# EAGLE design DIY_OpenEVSE_Arduino_Shield (EAGLE 6.2)
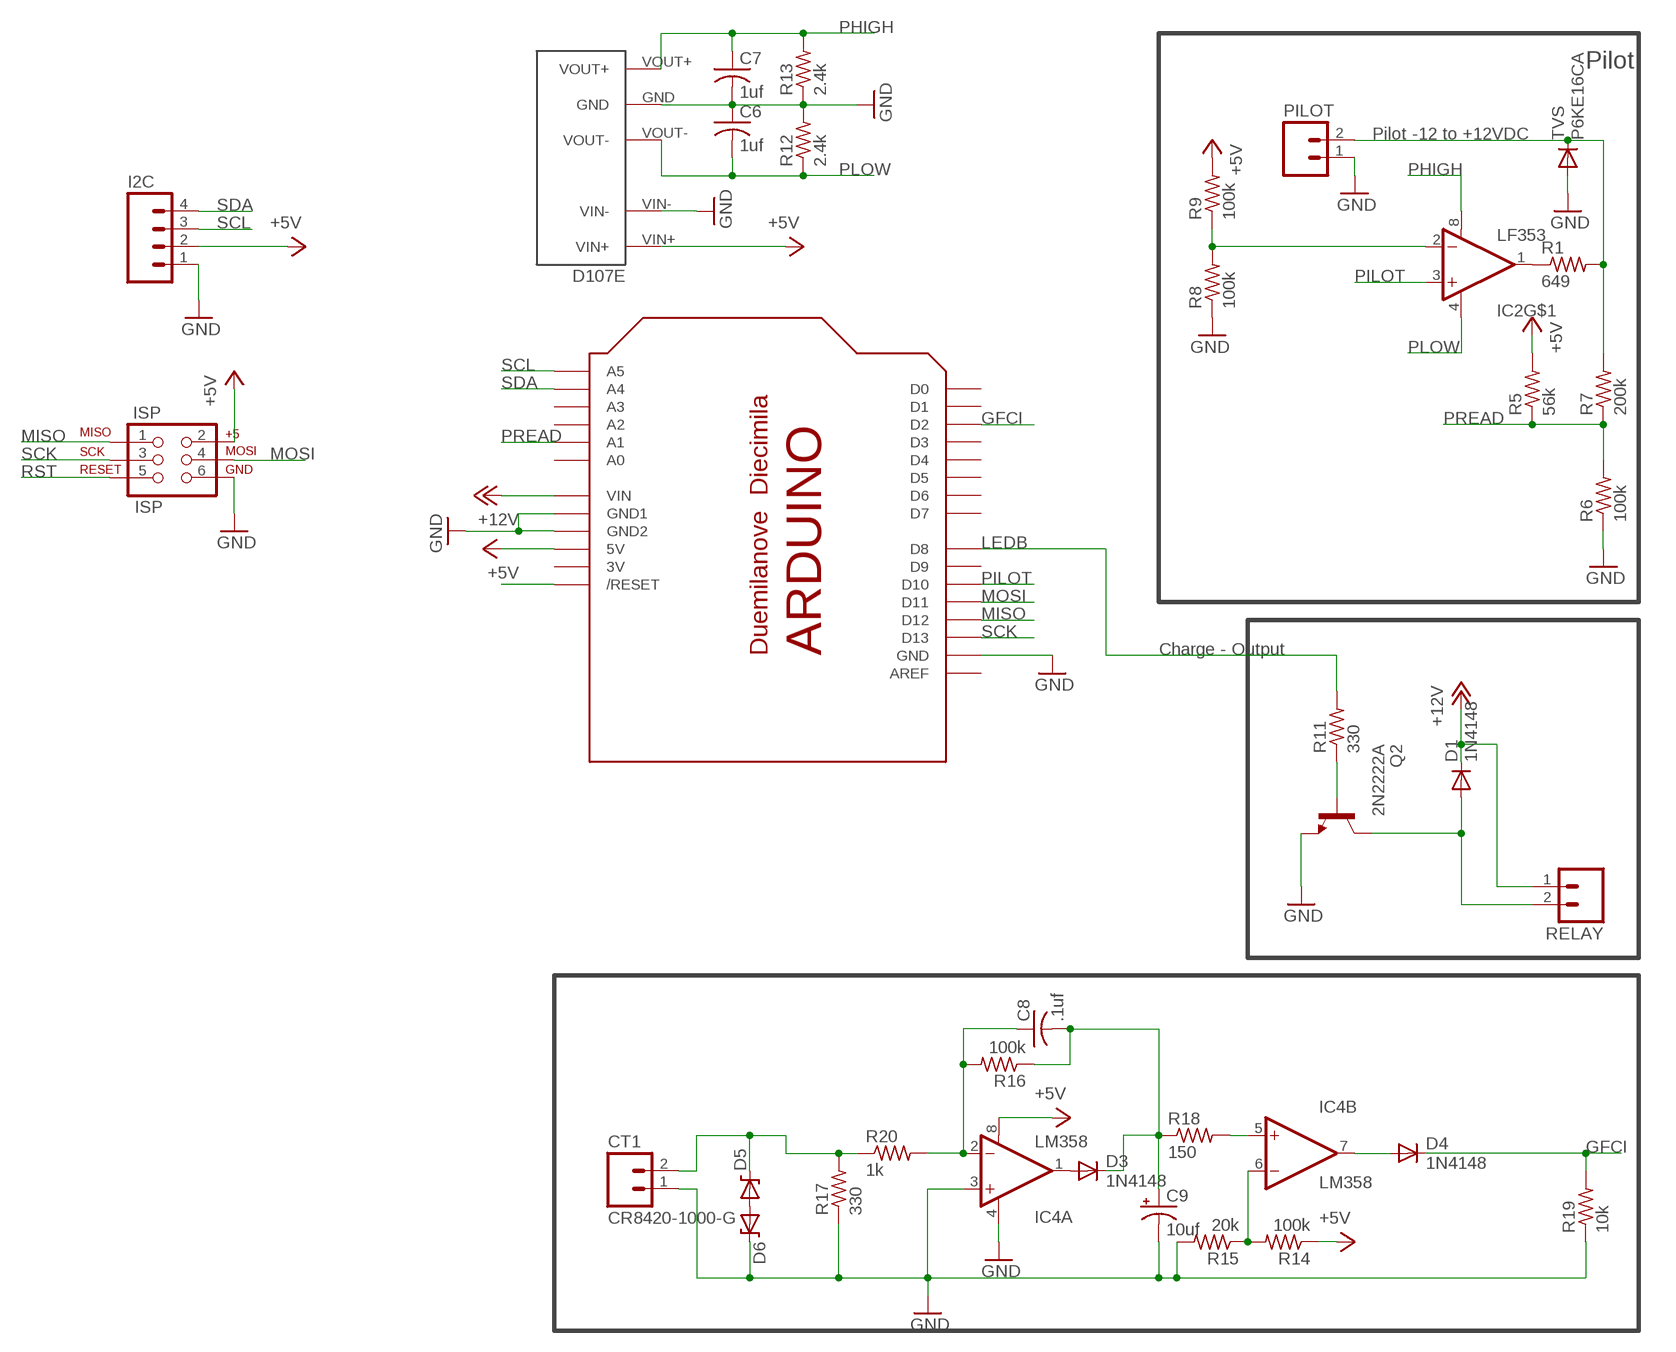
[diagram p0: schematic, sheet 1]

## Parts
C6  1uf  C-US025-024X044  [C025-024X044]
C7  1uf  C-US025-024X044  [C025-024X044]
C8  .1uf  C-US025-024X044  [C025-024X044]
C9  10uf  CAP_POLPTH2  [CPOL-RADIAL-10UF-25V]
CT1  CR8420-1000-G  M02LOCK  [1X02_LOCK]
D1  1N4148  DIODE1N4148  [DIODE-1N4148]
D3  1N4148  DIODE1N4148  [DIODE-1N4148]
D4  1N4148  DIODE1N4148  [DIODE-1N4148]
D5  DIODE-ZENERPTH  [DIODE-ZENER]
D6  DIODE-ZENERPTH  [DIODE-ZENER]
I2C  M04LOCK  [1X04_LOCK]
IC2  LF353  LM358  [DIP08]
IC4  LM358  OPAMP-DUALDIP  [DIP08]
ISP  ISP  AVR_SPI_PRG_62X3_LOCK  [2X3_LOCK]
PILOT  M025MM  [SCREWTERMINAL-5MM-2]
Q2  2N2222A  [TO18]
R1  649  R-US_0204/7  [0204/7]
R5  56k  R-US_0204/7  [0204/7]
R6  100k  R-US_0204/7  [0204/7]
R7  200k  R-US_0204/7  [0204/7]
R8  100k  R-US_0204/7  [0204/7]
R9  100k  R-US_0204/7  [0204/7]
R11  330  R-US_0204/7  [0204/7]
R12  2.4k  R-US_0204/7  [0204/7]
R13  2.4k  R-US_0204/7  [0204/7]
R14  100k  R-US_0204/7  [0204/7]
R15  20k  R-US_0204/7  [0204/7]
R16  100k  R-US_0204/7  [0204/7]
R17  330  R-US_0204/7  [0204/7]
R18  150  R-US_0204/7  [0204/7]
R19  10k  R-US_0204/7  [0204/7]
R20  1k  R-US_0204/7  [0204/7]
RELAY  M023.5MM_LOCK  [SCREWTERMINAL-3.5MM-2_LOCK]
TVS  P6KE16CA  DIODEPTH  [DIODE-1N4001]
U$1  DCDC_SIP  [DCDC_SIP]
U$2  ARDUINOUNO  [ARDUINO]

## Nets
+5V: I2C.2 IC4.8(A:V+) ISP.2 R5.2 R9.2 R14.1 U$1.VIN+ U$2.5V
+12V: D1.C RELAY.1 U$2.VIN
GFCI: D4.C R19.2 U$2.D2
GND: C6.1 C7.2 C9.2(-) CT1.1 D6.P$1(C) I2C.1 IC4.3(A:+IN) IC4.4(A:V-) ISP.6 PILOT.1 Q2.1(E) R6.1 R8.1 R12.2 R13.1 R15.2 R17.1 R19.1 TVS.A U$1.GND U$1.VIN- U$2.GND U$2.GND1 U$2.GND2
LEDB: R11.2 U$2.D8
MISO: ISP.1 U$2.D12
MOSI: ISP.4 U$2.D11
N$2: Q2.2(B) R11.1
N$3: PILOT.2 R1.2 R7.2 TVS.C
N$10: IC2.2(-IN) R8.2 R9.1
N$11: IC2.1(OUT) R1.1
N$13: D1.A Q2.3(C) RELAY.2
N$18: C8.1 IC4.2(A:-IN) R16.2 R20.2
N$19: IC4.5(B:+IN) R18.2
N$20: CT1.2 D5.P$1(C) R17.2 R20.1
N$21: D3.A IC4.1(A:OUT)
N$22: D5.P$2(A) D6.P$2(A)
N$23: C8.2 C9.1(+) D3.C R16.1 R18.1
N$24: IC4.6(B:-IN) R14.2 R15.1
N$25: D4.A IC4.7(B:OUT)
PHIGH: C7.1 IC2.8(V+) R13.2 U$1.VOUT+
PILOT: IC2.3(+IN) U$2.D10
PLOW: C6.2 IC2.4(V-) R12.1 U$1.VOUT-
PREAD: R5.1 R6.2 R7.1 U$2.A1
RST: ISP.5 U$2.RESET(/RESET)
SCK: ISP.3 U$2.D13
SCL: I2C.3 U$2.A5
SDA: I2C.4 U$2.A4
Unconnected: IC2.5(+IN) IC2.6(-IN) IC2.7(OUT) U$2.A0 U$2.A2 U$2.A3 U$2.AREF U$2.D0 U$2.D1 U$2.D3 U$2.D4 U$2.D5 U$2.D6 U$2.D7 U$2.D9

## Notes on the sheet
- Pilot
- Pilot -12 to +12VDC
- D107E
- Charge - Output

## Power pins joined to a net without a drawn wire
3V: U$2.3V

## Library data of the parts
C6-C8 = adafruit:C-US: CAPACITOR, American symbol
C9 = SparkFun:CAP_POL: Capacitor Polarized These are standard SMD and PTH capacitors. Normally 10uF, 47uF, and 100uF in electrolytic and tantalum varieties. Always verify the external diameter of the through hole cap, it varies with capacity, voltage, and manufacturer. The EIA devices should be standard.
CT1 PILOT RELAY = SparkFun:M02: Header 2 Standard 2-pin 0.1" header. Use with straight break away headers (SKU : PRT-00116), right angle break away headers (PRT-00553), swiss pins (PRT-00743), machine pins (PRT-00117), and female headers (PRT-00115). Molex polarized connector foot print use with SKU : PRT-08233 with associated crimp pins and housings.
D1 D3 D4 TVS = SparkFun:DIODE: Diode These are standard reverse protection diodes and small signal diodes. SMA package can handle up to about 1A. SOD-323 can handle about 200mA. What the SOD-323 package when ordering, there are some mfgs out there that are 5-pin packages.
D5 D6 = SparkFun:DIODE-ZENER: Zener Diode Production Part - 8199 3.4V Zener Voltage
I2C = SparkFun:M04: Header 4 Standard 4-pin 0.1" header. Use with straight break away headers (SKU : PRT-00116), right angle break away headers (PRT-00553), swiss pins (PRT-00743), machine pins (PRT-00117), and female headers (PRT-00115). Molex polarized connector foot print use with SKU : PRT-08231 with associated crimp pins and housings. 1MM SMD Version SKU: PRT-10208
IC2 = SparkFun:LM358
IC4 = SparkFun:OPAMP-DUAL: Operational Amplifier
ISP = SparkFun:AVR_SPI_PRG_6: AVR ISP 6 Pin This is the reduced ISP connector for AVR programming. Common on Arduino. This footprint will take up less PCB space and can be used with a 10-pin to 6-pin adapter such as SKU: BOB-08508
Q2 = transistor-npn:2N2222*: NPN Transistor
R1 R5-R9 R11-R20 = adafruit:R-US_: RESISTOR, American symbol
U$1 = Qxd:DCDC_SIP
U$2 = adafruit:ARDUINO: Arduino Diecimila/Duemilanove Make a shield with ease, this package has all the named pins as well as the two mounting drill holes and an outline of the USB and DC power connector. The outline is on the DIMENSION layer, so if your board house uses it they will cut the outline to match. http://www.ladyada.net/library/pcb/eaglelibrary.html

## Board
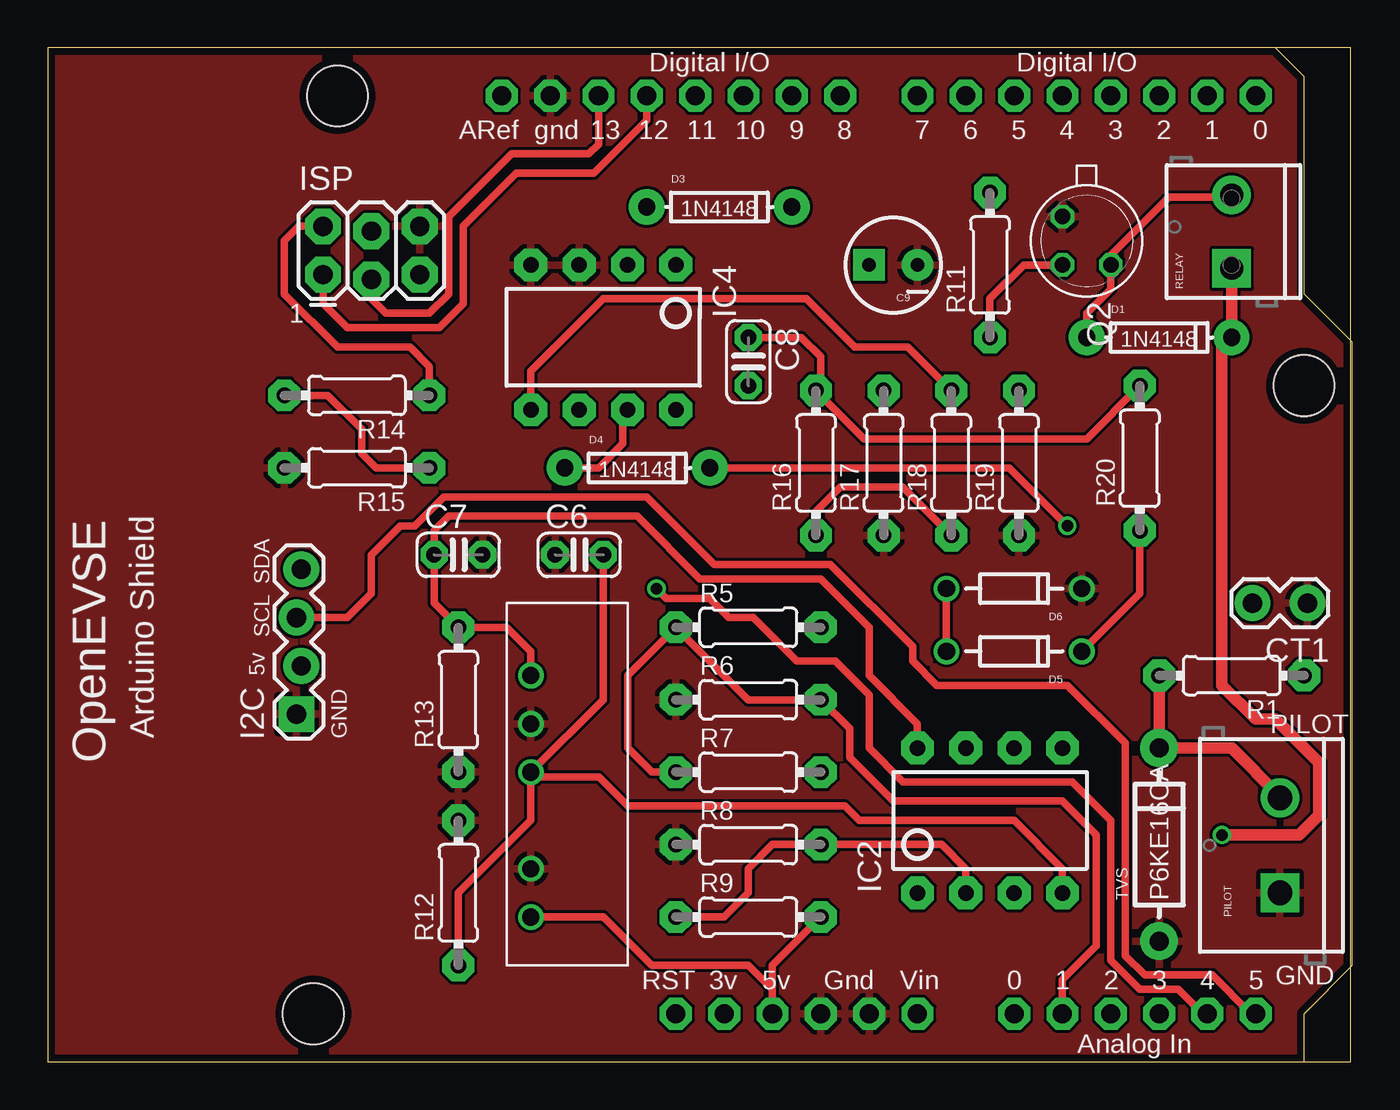
[diagram p1: board, top side]
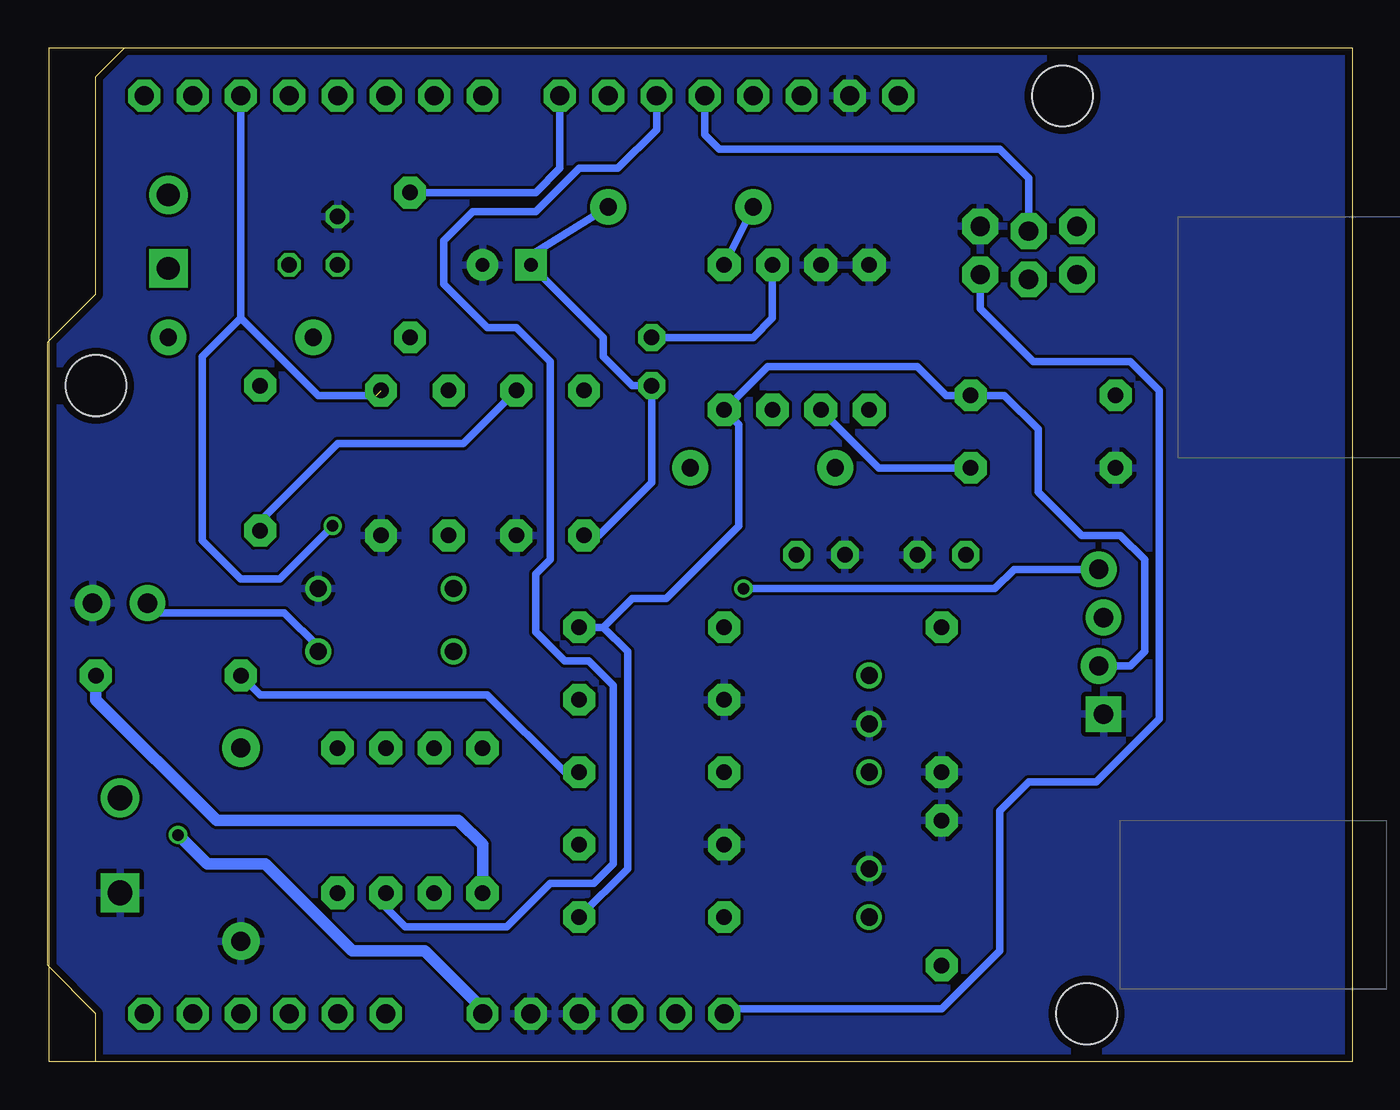
[diagram p2: board, bottom side, seen from below]

Size 68.5 x 53.33 mm. Coordinates in mm from the lower left corner, seen from the top.
Outline: 0,0 68.5,0 68.5,53.33 0,53.33 0,0
Copper layers (1*16): Top 0.0356mm / dielectric 1.5011mm / Bottom 0.0356mm
Design rules: minimum track width 6mil, minimum drill 13mil, track to track 6mil, track to pad 6mil, pad to pad 6mil, via to via 6mil, smd to smd 6mil, copper to edge 15mil, drill to drill 6mil, minimum pad ring 7mil, minimum via ring 7mil, stop-mask expansion 4mil, vias tented up to drill 0mil, thermal gap 10mil

### Footprints (pad centres in the part's own frame; a part is rotated, then mirrored left to right if it is on the bottom)
C025-024X044 = drill 0.813 pad 1.422 octagon: 1 -1.27,0; 2 1.27,0
CPOL-RADIAL-10UF-25V = drill 0.7 pad 1.651 square: 1 1.27,0 | drill 0.7 pad 1.651: 2 -1.27,0
1X02_LOCK = drill 1.016 pad 1.88: 1 -0.178,0; 2 2.718,0
DIODE-1N4148 = drill 0.9 pad 1.88: A -3.81,0; C 3.81,0
DIODE-ZENER = drill 0.9: P$1 -3.556,0; P$2 3.556,0
1X04_LOCK = drill 1.016 pad 1.88 square: 1 0,0.127 | drill 1.016 pad 1.88: 2 2.54,-0.127; 3 5.08,0.127; 4 7.62,-0.127
DIP08 = drill 0.813 pad 1.727 octagon: 1 -3.81,-3.81; 2 -1.27,-3.81; 3 1.27,-3.81; 4 3.81,-3.81; 5 3.81,3.81; 6 1.27,3.81; 7 -1.27,3.81; 8 -3.81,3.81
2X3_LOCK = drill 1.016 pad 1.88 octagon: 1 0,0; 2 0,2.54; 3 2.54,-0.254; 4 2.54,2.286; 5 5.08,0; 6 5.08,2.54
SCREWTERMINAL-5MM-2 = drill 1.3 pad 2.032 square: 1 0,0 | drill 1.3 pad 2.032: 2 5,0
TO18 = drill 0.813 octagon: 1 -1.27,-1.27; 2 1.27,-1.27; 3 1.27,1.27
0204/7 = drill 0.813 pad 1.676 octagon: 1 -3.81,0; 2 3.81,0
SCREWTERMINAL-3.5MM-2_LOCK = drill 1.2 pad 2.032 square: 1 -0.178,0 | drill 1.2 pad 2.032: 2 3.678,0
DIODE-1N4001 = drill 1 pad 1.981: A -5.08,0; C 5.08,0
DCDC_SIP = drill 0.9: GND 10.16,0; VIN+ 0,0; VIN- 2.54,0; VOUT+ 12.7,0; VOUT- 7.62,0
ARDUINO = drill 1 pad 1.676 octagon: 3V 35.56,2.54; 5V 38.1,2.54; A0 50.8,2.54; A1 53.34,2.54; A2 55.88,2.54; A3 58.42,2.54; A4 60.96,2.54; A5 63.5,2.54; AREF 23.876,50.8; D0 63.5,50.8; D1 60.96,50.8; D2 58.42,50.8; D3 55.88,50.8; D4 53.34,50.8; D5 50.8,50.8; D6 48.26,50.8; D7 45.72,50.8; D8 41.656,50.8; D9 39.116,50.8; D10 36.576,50.8; D11 34.036,50.8; D12 31.496,50.8; D13 28.956,50.8; GND 26.416,50.8; GND1 43.18,2.54; GND2 40.64,2.54; RESET 33.02,2.54; VIN 45.72,2.54 | hole 3.2: 15.24,50.8; 66.04,35.56; 13.97,2.54

### Placement (x,y rotation side)
C6  27.94,26.67 0 top
C7  21.59,26.67 0 top
C8  36.83,36.83 270 top
C9  44.45,41.91 180 top
CT1  66.04,24.13 180 top
D1  58.42,38.1 0 top
D3  35.31,44.96 0 top
D4  30.99,31.24 0 top
D5  50.8,21.59 180 top
D6  50.8,24.89 180 top
I2C  13.21,18.29 90 top
IC2  49.53,12.7 0 top
IC4  29.21,38.1 180 top
ISP  14.48,41.4 0 top
PILOT  64.77,8.89 90 top
Q2  54.61,43.18 270 top
R1  62.23,20.32 180 top
R5  36.83,22.86 0 top
R6  36.83,19.05 0 top
R7  36.83,15.24 0 top
R8  36.83,11.43 0 top
R9  36.83,7.62 0 top
R11  49.53,41.91 90 top
R12  21.59,8.89 90 top
R13  21.59,19.05 90 top
R14  16.26,35.05 180 top
R15  16.26,31.24 180 top
R16  40.39,31.5 90 top
R17  43.94,31.5 90 top
R18  47.5,31.5 90 top
R19  51.05,31.5 90 top
R20  57.4,31.75 90 top
RELAY  62.23,41.91 90 top
TVS  58.42,11.43 90 top
U$1  25.4,7.62 90 top
U$2  0,0 0 top

### Tracks (layer width: path | path; a pad name or v marks a point on that pad's centre or on a via)
+5V
  Top 0.406: 38.1,3.81 U$2.5V | 38.1,3.81 38.1,5.08 R9.2 | U$1.VIN+ 29.21,7.62 31.75,5.08 36.83,5.08 38.1,3.81 | R14.1 20.07,36.58 19.05,37.59 15.24,37.59 12.45,40.39 12.45,43.18 13.21,43.94 ISP.2
  Bottom 0.406: 39.37,22.86 R5.2 | 39.37,22.86 38.1,21.59 38.1,10.16 R9.2 | 39.37,22.86 37.85,24.38 36.07,24.38 32.26,28.19 32.26,33.53 IC4.8 30.73,36.58 22.86,36.58 21.34,35.05 R14.1 18.29,35.05 16.51,33.27 16.51,29.97 14.22,27.69 12.19,27.69 10.92,26.42 10.92,21.59 11.68,20.83 I2C.2
+12V  (via drill 0.6)
  Top 0.61: RELAY.1 D1.C 61.72,37.59 61.72,19.81 63.5,18.03 64.52,18.03 66.8,15.75 66.8,12.95 65.79,11.94 v61.72,11.94
  Bottom 0.61: U$2.VIN 45.72,2.79 48.77,5.84 52.58,5.84 57.15,10.41 60.2,10.41 v61.72,11.94
GFCI  (via drill 0.6)  (1 unrouted)
  Top 0.406: v53.59,28.19 50.55,31.24 D4.C
  Bottom 0.406: 58.42,39.12 U$2.D2 | 58.42,39.12 54.36,35.05 51.31,35.05 | v53.59,28.19 56.39,25.4 58.42,25.4 60.45,27.43 60.45,37.08 58.42,39.12
GND
  pour Top: -2.54,-1.27 74.93,-1.27 74.93,62.23 -2.54,62.23
  pour Bottom: -2.54,-1.27 71.12,-1.27 71.12,58.42 -2.54,58.42
LEDB
  Bottom 0.406: U$2.D8 41.66,46.99 42.93,45.72 R11.2
MISO
  Top 0.406: U$2.D12 31.5,49.53 28.7,46.74 24.64,46.74 21.84,43.94 21.84,39.88 20.57,38.61 15.75,38.61 14.48,39.88 ISP.1
MOSI
  Bottom 0.406: U$2.D11 34.04,48.77 33.27,48.01 18.54,48.01 17.02,46.48 ISP.4
N$2
  Top 0.406: Q2.2 51.31,41.91 49.53,40.13 R11.1
N$3
  Top 0.61: PILOT.2 64.77,13.97 62.23,16.51 TVS.C R1.2
  Bottom 0.406: R7.2 41.4,15.24 45.47,19.3 57.4,19.3 R1.2
N$10
  Top 0.406: R9.1 35.56,7.62 36.83,8.89 36.83,10.16 38.1,11.43 R8.2 46.99,11.43 48.26,10.16 IC2.2
N$11
  Bottom 0.61: IC2.1 45.72,11.43 46.99,12.7 59.69,12.7 66.04,19.05 R1.1
N$13
  Top 0.406: D1.A 54.61,39.37 55.88,40.64 Q2.3 55.88,42.42 58.93,45.47 62.11,45.47 RELAY.2
N$18
  Top 0.406: R20.2 54.61,32.77 42.93,32.77 R16.2 40.64,35.56 40.64,37.08 39.62,38.1 C8.1
  Bottom 0.406: C8.1 31.5,38.1 30.48,39.12 IC4.2
N$19
  Top 0.406: IC4.5 25.4,36.32 29.21,40.13 39.88,40.13 42.42,37.59 45.21,37.59 R18.2
N$20
  Top 0.406: R20.1 57.4,24.64 D5.P$1
  Bottom 0.406: D5.P$1 54.36,21.84 56.13,23.62 62.81,23.62 CT1.2 | R20.1 57.4,28.45 53.34,32.51 46.74,32.51 R17.2
N$21
  Bottom 0.406: IC4.1 D3.A
N$22
  Top 0.406: D5.P$2 D6.P$2
N$23
  Top 0.406: R16.1 40.39,28.96 41.66,30.23 44.96,30.23 R18.1
  Bottom 0.406: R16.1 39.62,27.69 36.83,30.48 C8.2 37.85,35.56 39.37,37.08 39.37,38.1 C9.1 43.18,42.42 D3.C
N$24
  Top 0.406: R14.2 14.73,35.05 16.51,33.27 16.51,32 17.27,31.24 R15.1
  Bottom 0.406: R15.1 24.89,31.24 IC4.6
N$25
  Top 0.406: D4.A 28.96,31.24 30.23,32.51 30.23,34.04 IC4.7
PHIGH
  Top 0.406: IC2.8 45.72,17.78 43.18,20.32 43.18,22.86 40.64,25.4 34.29,25.4 30.99,28.7 21.08,28.7 20.32,27.94 C7.1 20.32,24.13 R13.2 24.13,22.86 25.4,21.59 U$1.VOUT+
PILOT
  Bottom 0.406: IC2.3 50.8,8.13 49.78,7.11 44.45,7.11 42.16,9.4 39.88,9.4 38.86,10.41 38.86,19.81 40.13,21.08 41.4,21.08 42.93,22.61 42.93,25.65 42.16,26.42 42.16,36.83 43.94,38.61 45.47,38.61 47.75,40.89 47.75,43.18 46.23,44.7 42.93,44.7 40.64,46.99 38.61,46.99 36.58,49.02 U$2.D10
PLOW
  Top 0.406: U$1.VOUT- 25.4,12.7 21.59,8.89 R12.1 | C6.2 29.21,19.05 U$1.VOUT- | U$1.VOUT- 25.65,14.99 28.96,14.99 30.48,13.46 41.91,13.46 42.67,12.7 50.8,12.7 53.34,10.16 IC2.4
PREAD
  Top 0.406: R7.1 31.75,15.24 30.48,16.51 30.48,20.32 R5.1 36.83,19.05 R6.2 42.16,17.53 42.16,16 44.45,13.72 53.34,13.72 55.12,11.94 55.12,6.1 53.34,4.32 U$2.A1
RST
  Bottom 0.406: ISP.5 19.56,39.62 16.76,36.83 11.68,36.83 10.16,35.31 10.16,18.03 13.46,14.73 17.02,14.73 18.54,13.21 18.54,5.84 21.59,2.79 32.77,2.79 U$2.RESET
SCK
  Top 0.406: U$2.D13 28.96,48.26 28.45,47.75 24.38,47.75 21.08,44.45 21.08,40.39 20.07,39.37 17.78,39.37 17.02,40.13 ISP.3
SCL
  Top 0.406: U$2.A5 63.25,2.54 61.21,4.57 57.66,4.57 56.64,5.59 56.64,16.76 53.59,19.81 46.74,19.81 45.47,21.08 45.47,21.84 41.15,26.16 35.05,26.16 31.5,29.72 20.83,29.72 19.3,28.19 18.54,28.19 17.02,26.67 17.02,24.64 15.75,23.37 I2C.3
SDA  (via drill 0.6)
  Top 0.406: U$2.A4 60.71,2.54 59.44,3.81 57.4,3.81 55.88,5.33 55.88,12.7 53.85,14.73 44.96,14.73 43.18,16.51 43.18,19.3 41.4,21.08 39.37,21.08 37.08,23.37 35.81,23.37 34.8,24.38 32.51,24.38 v32,24.89
  Bottom 0.406: v32,24.89 18.8,24.89 17.78,25.91 I2C.4

### Text on the board
tNames: 1 | SDA | SCL | 5v | Arduino Shield | GND | PILOT | OpenEVSE | GND